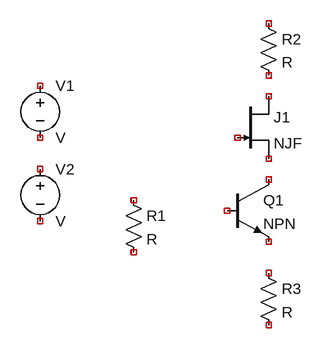
[diagram p0: schematic jfet-polarization-source-current.asc]
jfet-polarization-source-current.asc, the LTspice schematic file:
Version 4
SHEET 1 880 680
SYMBOL voltage -48 64 R0
SYMATTR InstName V1
SYMBOL voltage -48 192 R0
SYMATTR InstName V2
SYMBOL njf 256 96 R0
SYMATTR InstName J1
SYMBOL npn 240 224 R0
SYMATTR InstName Q1
SYMBOL res 80 240 R0
SYMATTR InstName R1
SYMBOL res 288 -32 R0
SYMATTR InstName R2
SYMBOL res 288 352 R0
SYMATTR InstName R3

The netlist it stands for:
* jfet-polarization-source-current.asc
V1 NC_01 NC_02 V
V2 NC_03 NC_04 V
J1 NC_05 NC_06 NC_07 NJF
Q1 NC_08 NC_09 NC_10 0 NPN
R1 NC_11 NC_12 R
R2 NC_13 NC_14 R
R3 NC_15 NC_16 R
.model NPN NPN
.model PNP PNP
.lib standard.bjt
.model NJF NJF
.model PJF PJF
.lib standard.jft
.backanno
.end